# EAGLE schematic humiditySensorFiverr - Copy (EAGLE 9.6.2)
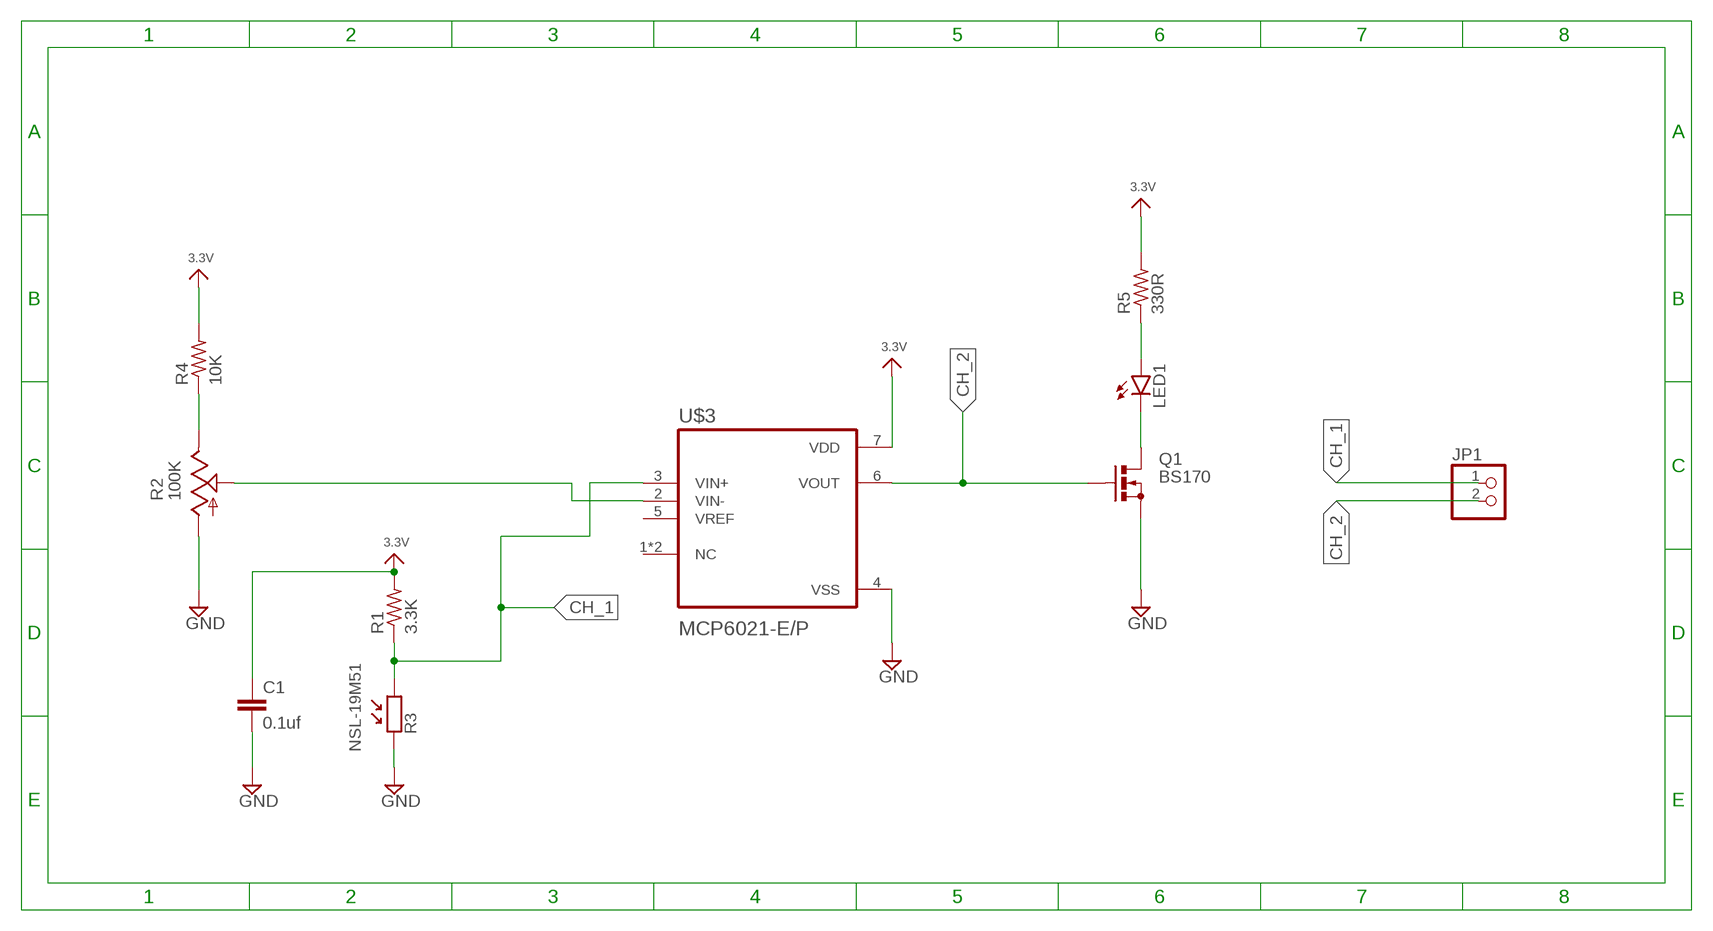
[diagram p0: schematic, sheet 1]

## Parts
C1  0.1uf  C-EU025-025X050  [C025-025X050]
JP1  PINHD-1X2  [1X02]
LED1  LED5MM  [LED5MM]
Q1  BS170  [SOT54E]
R1  3.3K  R-US_0204/7  [0204/7]
R2  100K  TRIM_US-CA6V  [CA6V]
R3  NSL-19M51  [NSL_19M51]
R4  10K  R-US_0204/7  [0204/7]
R5  330R  R-US_0204/7  [0204/7]
U$3  MCP6021-E/P  [DIP787W46P254L927H533Q8]

## Nets
3.3V: C1.1 R1.2 R4.2 R5.2 U$3.7(VDD)
CH_1: JP1.1 R1.1 R3.2 U$3.3(VIN+)
CH_2: JP1.2 Q1.G U$3.6(VOUT)
GND: C1.2 Q1.S R2.A R3.1 U$3.4(VSS)
N$1: R2.E R4.1
N$2: LED1.A R5.1
N$3: LED1.K(C) Q1.D
N$5: R2.S U$3.2(VIN-)
Unconnected: U$3.1(NC) U$3.5(VREF) U$3.8(NC)

## Library data of the parts
C1 = rcl:C-EU: CAPACITOR, European symbol; SPICEPREFIX: C
JP1 = pinhead:PINHD-1X2: PIN HEADER
LED1 = led:LED: LED OSRAM: - CHIPLED LG R971, LG N971, LY N971, LG Q971, LY Q971, LO R971, LY R971 LH N974, LH R974 LS Q976, LO Q976, LY Q976 LO Q996 - Hyper CHIPLED LW Q18S LB Q993, LB Q99A, LB R99A - SideLED LS A670, LO A670, LY A670, LG A670, LP A670 LB A673, LV A673, LT A673, LW A673 LH A674 LY A675 LS A676, LA A676, LO A676, LY A676, LW A676 LS A679, LY A679, LG A679 - Hyper Micro SIDELED® LS Y876, LA Y876, LO Y876, LY Y876 LT Y87S - SmartLED LW L88C, LW L88S LB L89C, LB L89S, LG L890 LS L89K, LO L89K, LY L89K LS L896, LA L896, LO L896, LY L896 - TOPLED LS T670, LO T670, LY T670, LG T670, LP T670 LSG T670, LSP T670, LSY T670, LOP T670, LYG T670 LG T671, LOG T671, LSG T671 LB T673, LV T673, LT T673, LW T673 LH T674 LS T676, LA T676, LO T676, LY T676, LB T676, LH T676, LSB T676, LW T676 LB T67C, LV T67C, LT T67C, LS T67K, LO T67K, LY T67K, LW E67C LS E67B, LA E67B, LO E67B, LY E67B, LB E67C, LV E67C, LT E67C LW T67C LS T679, LY T679, LG T679 LS T770, LO T770, LY T770, LG T770, LP T770 LB T773, LV T773, LT T773, LW T773 LH T774 LS E675, LA E675, LY E675, LS T675 LS T776, LA T776, LO T776, LY T776, LB T776 LHGB T686 LT T68C, LB T68C - Hyper Mini TOPLED® LB M676 - Mini TOPLED Santana® LG M470 LS M47K, LO M47K, LY M47K Source: http://www.osram.convergy.de LUXEON: - LUMILED® LXK2-PW12-R00, LXK2-PW12-S00, LXK2-PW14-U00, LXK2-PW14-V00 LXK2-PM12-R00, LXK2-PM12-S00, LXK2-PM14-U00 LXK2-PE12-Q00, LXK2-PE12-R00, LXK2-PE12-S00, LXK2-PE14-T00, LXK2-PE14-U00 LXK2-PB12-K00, LXK2-PB12-L00, LXK2-PB12-M00, LXK2-PB14-N00, LXK2-PB14-P00, LXK2-PB14-Q00 LXK2-PR12-L00, LXK2-PR12-M00, LXK2-PR14-Q00, LXK2-PR14-R00 LXK2-PD12-Q00, LXK2-PD12-R00, LXK2-PD12-S00 LXK2-PH12-R00, LXK2-PH12-S00 LXK2-PL12-P00, LXK2-PL12-Q00, LXK2-PL12-R00 Source: www.luxeon.com KINGBRIGHT: KA-3528ASYC Source: www.kingbright.com
Q1 = transistor-small-signal:BS170: N-CHANNEL MOS FET
R1 R4 R5 = rcl:R-US_: RESISTOR, American symbol; SPICEPREFIX: R
R2 = pot:TRIM_US-: POTENTIOMETER
R3 = NSL-19M51:NSL-19M51: Check availability <https://pricing.snapeda.com/parts/NSL-19M51/Advanced%20Photonix/view-part?ref=eda>; AVAILABILITY: In Stock; DESCRIPTION: CdS Cells 550nm 20 ~ 100kOhms @ 10 lux; MF: Advanced Photonix; MP: NSL-19M51; PACKAGE: Radial Advanced Photonix; PRICE: None; PURCHASE-URL: https://pricing.snapeda.com/search?q=NSL-19M51&ref=eda
U$3 = MCP6021-E_P:MCP6021-E/P: Check availability <https://pricing.snapeda.com/parts/MCP6021-E/P/Microchip/view-part?ref=eda>; AVAILABILITY: In Stock; DESCRIPTION: General Purpose Amplifier 1 Circuit Rail-to-Rail 8-PDIP; MF: Microchip; MP: MCP6021-E/P; PACKAGE: DIP-8 Microchip; PRICE: None; PURCHASE-URL: https://pricing.snapeda.com/search?q=MCP6021-E/P&ref=eda